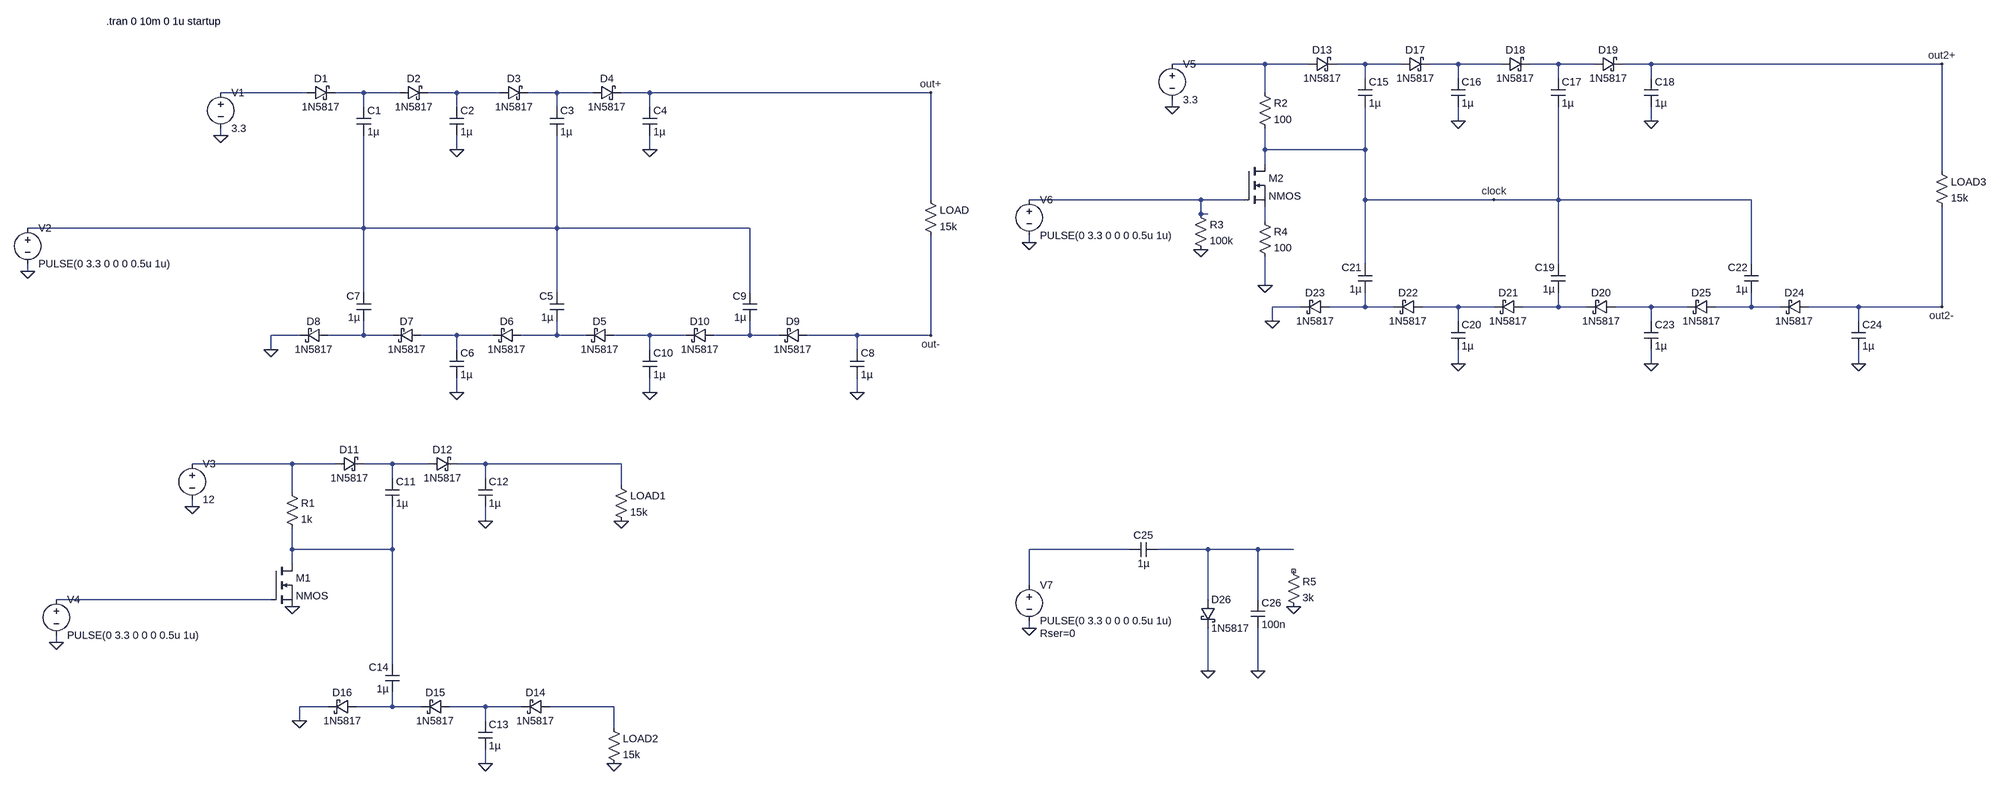
[diagram p0: schematic charge_pump.asc]
charge_pump.asc, the LTspice schematic file:
Version 4
SHEET 1 4136 1780
WIRE 2496 112 2288 112
WIRE 2592 112 2496 112
WIRE 2720 112 2656 112
WIRE 2800 112 2720 112
WIRE 2928 112 2864 112
WIRE 3024 112 2928 112
WIRE 3152 112 3088 112
WIRE 3232 112 3152 112
WIRE 3360 112 3296 112
WIRE 4032 112 3360 112
WIRE 2720 144 2720 112
WIRE 2928 144 2928 112
WIRE 3152 144 3152 112
WIRE 3360 144 3360 112
WIRE 128 176 -64 176
WIRE 256 176 192 176
WIRE 336 176 256 176
WIRE 464 176 400 176
WIRE 560 176 464 176
WIRE 688 176 624 176
WIRE 768 176 688 176
WIRE 896 176 832 176
WIRE 1568 176 896 176
WIRE 2496 176 2496 112
WIRE 256 208 256 176
WIRE 464 208 464 176
WIRE 688 208 688 176
WIRE 896 208 896 176
WIRE 2288 208 2288 192
WIRE 2928 240 2928 208
WIRE 3360 240 3360 208
WIRE -64 272 -64 256
WIRE 464 304 464 272
WIRE 896 304 896 272
WIRE 2496 304 2496 256
WIRE 2720 304 2720 208
WIRE 2720 304 2496 304
WIRE 2496 336 2496 304
WIRE 4032 352 4032 112
WIRE 1568 416 1568 176
WIRE 2352 416 1968 416
WIRE 2448 416 2352 416
WIRE 2720 416 2720 304
WIRE 3008 416 2720 416
WIRE 3152 416 3152 208
WIRE 3152 416 3008 416
WIRE 3584 416 3152 416
WIRE 2352 448 2352 416
WIRE 2368 448 2352 448
WIRE 2496 464 2496 432
WIRE 256 480 256 272
WIRE 256 480 -496 480
WIRE 688 480 688 272
WIRE 688 480 256 480
WIRE 1120 480 688 480
WIRE 1968 512 1968 496
WIRE 2720 560 2720 416
WIRE 3152 560 3152 416
WIRE 3584 560 3584 416
WIRE -496 576 -496 560
WIRE 2496 608 2496 544
WIRE 256 624 256 480
WIRE 688 624 688 480
WIRE 1120 624 1120 480
WIRE 2576 656 2512 656
WIRE 2720 656 2720 624
WIRE 2720 656 2640 656
WIRE 2784 656 2720 656
WIRE 2928 656 2848 656
WIRE 3008 656 2928 656
WIRE 3152 656 3152 624
WIRE 3152 656 3072 656
WIRE 3216 656 3152 656
WIRE 3360 656 3280 656
WIRE 3440 656 3360 656
WIRE 3584 656 3584 624
WIRE 3584 656 3504 656
WIRE 3648 656 3584 656
WIRE 3824 656 3712 656
WIRE 4032 656 4032 432
WIRE 4032 656 3824 656
WIRE 2512 688 2512 656
WIRE 2928 688 2928 656
WIRE 3360 688 3360 656
WIRE 3824 688 3824 656
WIRE 112 720 48 720
WIRE 256 720 256 688
WIRE 256 720 176 720
WIRE 320 720 256 720
WIRE 464 720 384 720
WIRE 544 720 464 720
WIRE 688 720 688 688
WIRE 688 720 608 720
WIRE 752 720 688 720
WIRE 896 720 816 720
WIRE 976 720 896 720
WIRE 1120 720 1120 688
WIRE 1120 720 1040 720
WIRE 1184 720 1120 720
WIRE 1360 720 1248 720
WIRE 1568 720 1568 496
WIRE 1568 720 1360 720
WIRE 48 752 48 720
WIRE 464 752 464 720
WIRE 896 752 896 720
WIRE 1360 752 1360 720
WIRE 2928 784 2928 752
WIRE 3360 784 3360 752
WIRE 3824 784 3824 752
WIRE 464 848 464 816
WIRE 896 848 896 816
WIRE 1360 848 1360 816
WIRE 96 1088 -128 1088
WIRE 192 1088 96 1088
WIRE 320 1088 256 1088
WIRE 400 1088 320 1088
WIRE 528 1088 464 1088
WIRE 832 1088 528 1088
WIRE 320 1120 320 1088
WIRE 528 1120 528 1088
WIRE 832 1136 832 1088
WIRE 96 1152 96 1088
WIRE -128 1184 -128 1168
WIRE 528 1216 528 1184
WIRE 96 1280 96 1232
WIRE 320 1280 320 1184
WIRE 320 1280 96 1280
WIRE 2192 1280 1968 1280
WIRE 2368 1280 2256 1280
WIRE 2480 1280 2368 1280
WIRE 2560 1280 2480 1280
WIRE 96 1312 96 1280
WIRE 1968 1360 1968 1280
WIRE 48 1392 -432 1392
WIRE 2368 1392 2368 1280
WIRE 2480 1392 2480 1280
WIRE 1968 1456 1968 1440
WIRE -432 1488 -432 1472
WIRE 320 1536 320 1280
WIRE 2368 1552 2368 1456
WIRE 2480 1552 2480 1456
WIRE 176 1632 112 1632
WIRE 320 1632 320 1600
WIRE 320 1632 240 1632
WIRE 384 1632 320 1632
WIRE 528 1632 448 1632
WIRE 608 1632 528 1632
WIRE 816 1632 672 1632
WIRE 112 1664 112 1632
WIRE 528 1664 528 1632
WIRE 816 1680 816 1632
WIRE 528 1760 528 1728
FLAG 464 304 0
FLAG -496 576 0
FLAG -64 272 0
FLAG 896 304 0
FLAG 464 848 0
FLAG 896 848 0
FLAG 48 752 0
FLAG 1360 848 0
FLAG 1568 176 out+
FLAG 1568 720 out-
FLAG 528 1216 0
FLAG -432 1488 0
FLAG -128 1184 0
FLAG 528 1760 0
FLAG 112 1664 0
FLAG 832 1216 0
FLAG 816 1760 0
FLAG 96 1408 0
FLAG 2928 240 0
FLAG 1968 512 0
FLAG 2288 208 0
FLAG 3360 240 0
FLAG 2928 784 0
FLAG 3360 784 0
FLAG 2512 688 0
FLAG 3824 784 0
FLAG 4032 112 out2+
FLAG 4032 656 out2-
FLAG 2496 608 0
FLAG 3008 416 clock
FLAG 2352 528 0
FLAG 1968 1456 0
FLAG 2368 1552 0
FLAG 2560 1408 0
FLAG 2480 1552 0
SYMBOL schottky 128 192 R270
WINDOW 0 32 32 VTop 2
WINDOW 3 0 32 VBottom 2
SYMATTR InstName D1
SYMATTR Value 1N5817
SYMATTR Description Diode
SYMATTR Type diode
SYMBOL schottky 336 192 R270
WINDOW 0 32 32 VTop 2
WINDOW 3 0 32 VBottom 2
SYMATTR InstName D2
SYMATTR Value 1N5817
SYMATTR Description Diode
SYMATTR Type diode
SYMBOL voltage -64 160 R0
WINDOW 123 0 0 Left 0
WINDOW 39 0 0 Left 0
SYMATTR InstName V1
SYMATTR Value 3.3
SYMBOL voltage -496 464 R0
WINDOW 123 0 0 Left 0
WINDOW 39 0 0 Left 0
SYMATTR InstName V2
SYMATTR Value PULSE(0 3.3 0 0 0 0.5u 1u)
SYMBOL cap 240 208 R0
SYMATTR InstName C1
SYMATTR Value 1µ
SYMBOL cap 448 208 R0
SYMATTR InstName C2
SYMATTR Value 1µ
SYMBOL schottky 560 192 R270
WINDOW 0 32 32 VTop 2
WINDOW 3 0 32 VBottom 2
SYMATTR InstName D3
SYMATTR Value 1N5817
SYMATTR Description Diode
SYMATTR Type diode
SYMBOL schottky 768 192 R270
WINDOW 0 32 32 VTop 2
WINDOW 3 0 32 VBottom 2
SYMATTR InstName D4
SYMATTR Value 1N5817
SYMATTR Description Diode
SYMATTR Type diode
SYMBOL cap 672 208 R0
SYMATTR InstName C3
SYMATTR Value 1µ
SYMBOL cap 880 208 R0
SYMATTR InstName C4
SYMATTR Value 1µ
SYMBOL schottky 816 704 R90
WINDOW 0 0 32 VBottom 2
WINDOW 3 32 32 VTop 2
SYMATTR InstName D5
SYMATTR Value 1N5817
SYMATTR Description Diode
SYMATTR Type diode
SYMBOL schottky 608 704 R90
WINDOW 0 0 32 VBottom 2
WINDOW 3 32 32 VTop 2
SYMATTR InstName D6
SYMATTR Value 1N5817
SYMATTR Description Diode
SYMATTR Type diode
SYMBOL cap 704 688 R180
WINDOW 0 24 56 Left 2
WINDOW 3 24 8 Left 2
SYMATTR InstName C5
SYMATTR Value 1µ
SYMBOL cap 448 752 R0
SYMATTR InstName C6
SYMATTR Value 1µ
SYMBOL schottky 384 704 R90
WINDOW 0 0 32 VBottom 2
WINDOW 3 32 32 VTop 2
SYMATTR InstName D7
SYMATTR Value 1N5817
SYMATTR Description Diode
SYMATTR Type diode
SYMBOL schottky 176 704 R90
WINDOW 0 0 32 VBottom 2
WINDOW 3 32 32 VTop 2
SYMATTR InstName D8
SYMATTR Value 1N5817
SYMATTR Description Diode
SYMATTR Type diode
SYMBOL cap 272 688 R180
WINDOW 0 24 56 Left 2
WINDOW 3 24 8 Left 2
SYMATTR InstName C7
SYMATTR Value 1µ
SYMBOL schottky 1248 704 R90
WINDOW 0 0 32 VBottom 2
WINDOW 3 32 32 VTop 2
SYMATTR InstName D9
SYMATTR Value 1N5817
SYMATTR Description Diode
SYMATTR Type diode
SYMBOL schottky 1040 704 R90
WINDOW 0 0 32 VBottom 2
WINDOW 3 32 32 VTop 2
SYMATTR InstName D10
SYMATTR Value 1N5817
SYMATTR Description Diode
SYMATTR Type diode
SYMBOL cap 1136 688 R180
WINDOW 0 24 56 Left 2
WINDOW 3 24 8 Left 2
SYMATTR InstName C9
SYMATTR Value 1µ
SYMBOL cap 880 752 R0
SYMATTR InstName C10
SYMATTR Value 1µ
SYMBOL cap 1344 752 R0
SYMATTR InstName C8
SYMATTR Value 1µ
SYMBOL res 1552 400 R0
SYMATTR InstName LOAD
SYMATTR Value 15k
SYMBOL schottky 192 1104 R270
WINDOW 0 32 32 VTop 2
WINDOW 3 0 32 VBottom 2
SYMATTR InstName D11
SYMATTR Value 1N5817
SYMATTR Description Diode
SYMATTR Type diode
SYMBOL schottky 400 1104 R270
WINDOW 0 32 32 VTop 2
WINDOW 3 0 32 VBottom 2
SYMATTR InstName D12
SYMATTR Value 1N5817
SYMATTR Description Diode
SYMATTR Type diode
SYMBOL voltage -128 1072 R0
WINDOW 123 0 0 Left 0
WINDOW 39 0 0 Left 0
SYMATTR InstName V3
SYMATTR Value 12
SYMBOL voltage -432 1376 R0
WINDOW 123 0 0 Left 0
WINDOW 39 0 0 Left 0
SYMATTR InstName V4
SYMATTR Value PULSE(0 3.3 0 0 0 0.5u 1u)
SYMBOL cap 304 1120 R0
SYMATTR InstName C11
SYMATTR Value 1µ
SYMBOL cap 512 1120 R0
SYMATTR InstName C12
SYMATTR Value 1µ
SYMBOL schottky 672 1616 R90
WINDOW 0 0 32 VBottom 2
WINDOW 3 32 32 VTop 2
SYMATTR InstName D14
SYMATTR Value 1N5817
SYMATTR Description Diode
SYMATTR Type diode
SYMBOL cap 512 1664 R0
SYMATTR InstName C13
SYMATTR Value 1µ
SYMBOL schottky 448 1616 R90
WINDOW 0 0 32 VBottom 2
WINDOW 3 32 32 VTop 2
SYMATTR InstName D15
SYMATTR Value 1N5817
SYMATTR Description Diode
SYMATTR Type diode
SYMBOL schottky 240 1616 R90
WINDOW 0 0 32 VBottom 2
WINDOW 3 32 32 VTop 2
SYMATTR InstName D16
SYMATTR Value 1N5817
SYMATTR Description Diode
SYMATTR Type diode
SYMBOL cap 336 1600 R180
WINDOW 0 24 56 Left 2
WINDOW 3 24 8 Left 2
SYMATTR InstName C14
SYMATTR Value 1µ
SYMBOL res 816 1120 R0
SYMATTR InstName LOAD1
SYMATTR Value 15k
SYMBOL res 800 1664 R0
SYMATTR InstName LOAD2
SYMATTR Value 15k
SYMBOL nmos 48 1312 R0
SYMATTR InstName M1
SYMBOL res 80 1136 R0
SYMATTR InstName R1
SYMATTR Value 1k
SYMBOL schottky 2592 128 R270
WINDOW 0 32 32 VTop 2
WINDOW 3 0 32 VBottom 2
SYMATTR InstName D13
SYMATTR Value 1N5817
SYMATTR Description Diode
SYMATTR Type diode
SYMBOL schottky 2800 128 R270
WINDOW 0 32 32 VTop 2
WINDOW 3 0 32 VBottom 2
SYMATTR InstName D17
SYMATTR Value 1N5817
SYMATTR Description Diode
SYMATTR Type diode
SYMBOL voltage 2288 96 R0
WINDOW 123 0 0 Left 0
WINDOW 39 0 0 Left 0
SYMATTR InstName V5
SYMATTR Value 3.3
SYMBOL voltage 1968 400 R0
WINDOW 123 0 0 Left 0
WINDOW 39 0 0 Left 0
SYMATTR InstName V6
SYMATTR Value PULSE(0 3.3 0 0 0 0.5u 1u)
SYMBOL cap 2704 144 R0
SYMATTR InstName C15
SYMATTR Value 1µ
SYMBOL cap 2912 144 R0
SYMATTR InstName C16
SYMATTR Value 1µ
SYMBOL schottky 3024 128 R270
WINDOW 0 32 32 VTop 2
WINDOW 3 0 32 VBottom 2
SYMATTR InstName D18
SYMATTR Value 1N5817
SYMATTR Description Diode
SYMATTR Type diode
SYMBOL schottky 3232 128 R270
WINDOW 0 32 32 VTop 2
WINDOW 3 0 32 VBottom 2
SYMATTR InstName D19
SYMATTR Value 1N5817
SYMATTR Description Diode
SYMATTR Type diode
SYMBOL cap 3136 144 R0
SYMATTR InstName C17
SYMATTR Value 1µ
SYMBOL cap 3344 144 R0
SYMATTR InstName C18
SYMATTR Value 1µ
SYMBOL schottky 3280 640 R90
WINDOW 0 0 32 VBottom 2
WINDOW 3 32 32 VTop 2
SYMATTR InstName D20
SYMATTR Value 1N5817
SYMATTR Description Diode
SYMATTR Type diode
SYMBOL schottky 3072 640 R90
WINDOW 0 0 32 VBottom 2
WINDOW 3 32 32 VTop 2
SYMATTR InstName D21
SYMATTR Value 1N5817
SYMATTR Description Diode
SYMATTR Type diode
SYMBOL cap 3168 624 R180
WINDOW 0 24 56 Left 2
WINDOW 3 24 8 Left 2
SYMATTR InstName C19
SYMATTR Value 1µ
SYMBOL cap 2912 688 R0
SYMATTR InstName C20
SYMATTR Value 1µ
SYMBOL schottky 2848 640 R90
WINDOW 0 0 32 VBottom 2
WINDOW 3 32 32 VTop 2
SYMATTR InstName D22
SYMATTR Value 1N5817
SYMATTR Description Diode
SYMATTR Type diode
SYMBOL schottky 2640 640 R90
WINDOW 0 0 32 VBottom 2
WINDOW 3 32 32 VTop 2
SYMATTR InstName D23
SYMATTR Value 1N5817
SYMATTR Description Diode
SYMATTR Type diode
SYMBOL cap 2736 624 R180
WINDOW 0 24 56 Left 2
WINDOW 3 24 8 Left 2
SYMATTR InstName C21
SYMATTR Value 1µ
SYMBOL schottky 3712 640 R90
WINDOW 0 0 32 VBottom 2
WINDOW 3 32 32 VTop 2
SYMATTR InstName D24
SYMATTR Value 1N5817
SYMATTR Description Diode
SYMATTR Type diode
SYMBOL schottky 3504 640 R90
WINDOW 0 0 32 VBottom 2
WINDOW 3 32 32 VTop 2
SYMATTR InstName D25
SYMATTR Value 1N5817
SYMATTR Description Diode
SYMATTR Type diode
SYMBOL cap 3600 624 R180
WINDOW 0 24 56 Left 2
WINDOW 3 24 8 Left 2
SYMATTR InstName C22
SYMATTR Value 1µ
SYMBOL cap 3344 688 R0
SYMATTR InstName C23
SYMATTR Value 1µ
SYMBOL cap 3808 688 R0
SYMATTR InstName C24
SYMATTR Value 1µ
SYMBOL res 4016 336 R0
SYMATTR InstName LOAD3
SYMATTR Value 15k
SYMBOL nmos 2448 336 R0
SYMATTR InstName M2
SYMBOL res 2480 160 R0
SYMATTR InstName R2
SYMATTR Value 100
SYMBOL res 2336 432 R0
SYMATTR InstName R3
SYMATTR Value 100k
SYMBOL res 2480 448 R0
SYMATTR InstName R4
SYMATTR Value 100
SYMBOL voltage 1968 1344 R0
WINDOW 123 0 0 Left 0
WINDOW 39 24 124 Left 2
SYMATTR SpiceLine Rser=0
SYMATTR InstName V7
SYMATTR Value PULSE(0 3.3 0 0 0 0.5u 1u)
SYMBOL schottky 2352 1392 R0
SYMATTR InstName D26
SYMATTR Value 1N5817
SYMATTR Description Diode
SYMATTR Type diode
SYMBOL cap 2192 1296 R270
WINDOW 0 32 32 VTop 2
WINDOW 3 0 32 VBottom 2
SYMATTR InstName C25
SYMATTR Value 1µ
SYMBOL res 2544 1312 R0
SYMATTR InstName R5
SYMATTR Value 3k
SYMBOL cap 2464 1392 R0
SYMATTR InstName C26
SYMATTR Value 100n
TEXT -320 16 Left 2 !.tran 0 10m 0 1u startup

The netlist it stands for:
* charge_pump.asc
D1 N005 N006 1N5817
D2 N006 N007 1N5817
V1 N005 0 3.3
V2 N011 0 PULSE(0 3.3 0 0 0 0.5u 1u)
C1 N006 N011 1µ
C2 N007 0 1µ
D3 N007 N008 1N5817
D4 N008 out+ 1N5817
C3 N008 N011 1µ
C4 out+ 0 1µ
D5 N020 N019 1N5817
D6 N019 N018 1N5817
C5 N019 N011 1µ
C6 N018 0 1µ
D7 N018 N017 1N5817
D8 N017 0 1N5817
C7 N017 N011 1µ
D9 out- N021 1N5817
D10 N021 N020 1N5817
C9 N021 N011 1µ
C10 N020 0 1µ
C8 out- 0 1µ
R§LOAD out+ out- 15k
D11 N022 N023 1N5817
D12 N023 N024 1N5817
V3 N022 0 12
V4 N028 0 PULSE(0 3.3 0 0 0 0.5u 1u)
C11 N023 N025 1µ
C12 N024 0 1µ
D14 N031 N030 1N5817
C13 N030 0 1µ
D15 N030 N029 1N5817
D16 N029 0 1N5817
C14 N029 N025 1µ
R§LOAD1 N024 0 15k
R§LOAD2 N031 0 15k
M1 N025 N028 0 0 NMOS
R1 N022 N025 1k
D13 N001 N002 1N5817
D17 N002 N003 1N5817
V5 N001 0 3.3
V6 N009 0 PULSE(0 3.3 0 0 0 0.5u 1u)
C15 N002 clock 1µ
C16 N003 0 1µ
D18 N003 N004 1N5817
D19 N004 out2+ 1N5817
C17 N004 clock 1µ
C18 out2+ 0 1µ
D20 N015 N014 1N5817
D21 N014 N013 1N5817
C19 N014 clock 1µ
C20 N013 0 1µ
D22 N013 N012 1N5817
D23 N012 0 1N5817
C21 N012 clock 1µ
D24 out2- N016 1N5817
D25 N016 N015 1N5817
C22 N016 clock 1µ
C23 N015 0 1µ
C24 out2- 0 1µ
R§LOAD3 out2+ out2- 15k
M2 clock N009 N010 N010 NMOS
R2 N001 clock 100
R3 N009 0 100k
R4 N010 0 100
V7 N026 0 PULSE(0 3.3 0 0 0 0.5u 1u) Rser=0
D26 N027 0 1N5817
C25 N026 N027 1µ
R5 NC_01 0 3k
C26 N027 0 100n
.model D D
.lib standard.dio
.model NMOS NMOS
.model PMOS PMOS
.lib standard.mos
.tran 0 10m 0 1u startup
.backanno
.end